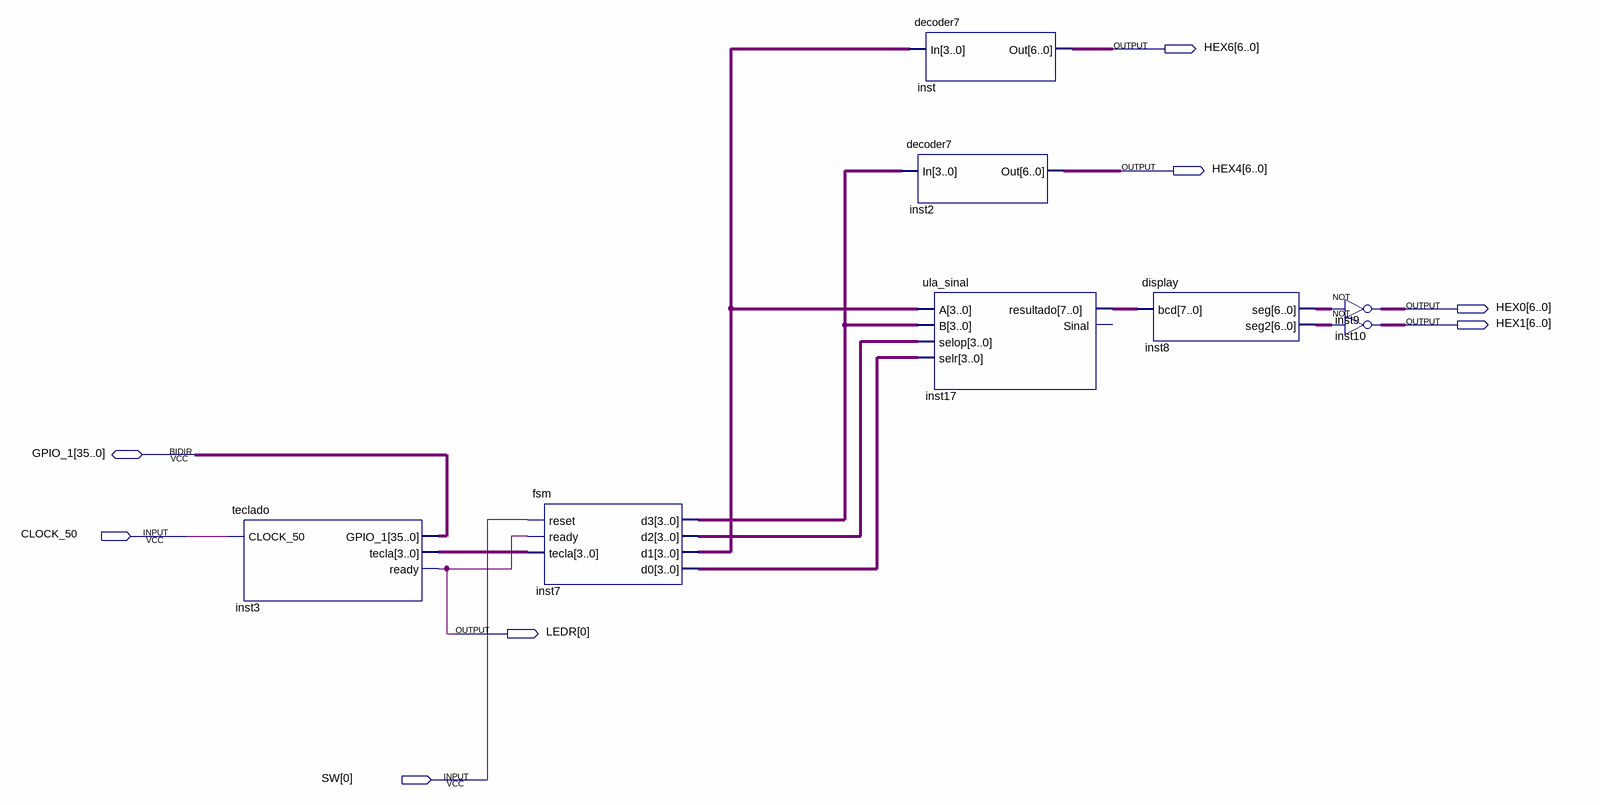
[diagram p0: schematic sheet]
// Quartus schematic Calculadora.bdf as structural Verilog: 8 symbols, 8 pins
module Calculadora (
  input  CLOCK_50,
  input  [0:0] SW,
  inout  [35:0] GPIO_1,
  output [6:0] HEX6,
  output [6:0] HEX4,
  output [6:0] HEX0,
  output [6:0] HEX1,
  output [0:0] LEDR
);

  wire [3:0] inst3_tecla, inst7_d0, inst7_d1, inst7_d2, inst7_d3;
  wire [6:0] inst8_seg, inst8_seg2;
  wire [7:0] inst17_resultado;

  teclado inst3 (.CLOCK_50(CLOCK_50), .tecla(inst3_tecla), .ready(LEDR[0]), .GPIO_1(GPIO_1));
  fsm inst7 (
    .reset(SW[0]), .ready(LEDR[0]), .tecla(inst3_tecla), .d3(inst7_d3), .d2(inst7_d2), .d1(inst7_d1),
    .d0(inst7_d0));
  decoder7 inst (.In(inst7_d1), .Out(HEX6));
  decoder7 inst2 (.In(inst7_d3), .Out(HEX4));
  ula_sinal inst17 (
    .A(inst7_d1), .B(inst7_d3), .selop(inst7_d2), .selr(inst7_d0), .resultado(inst17_resultado));  // open: Sinal
  display inst8 (.bcd(inst17_resultado), .seg(inst8_seg), .seg2(inst8_seg2));
  assign HEX0 = ~inst8_seg;  // NOT inst9, 7 bits wide
  assign HEX1 = ~inst8_seg2;  // NOT inst10, 7 bits wide
endmodule
